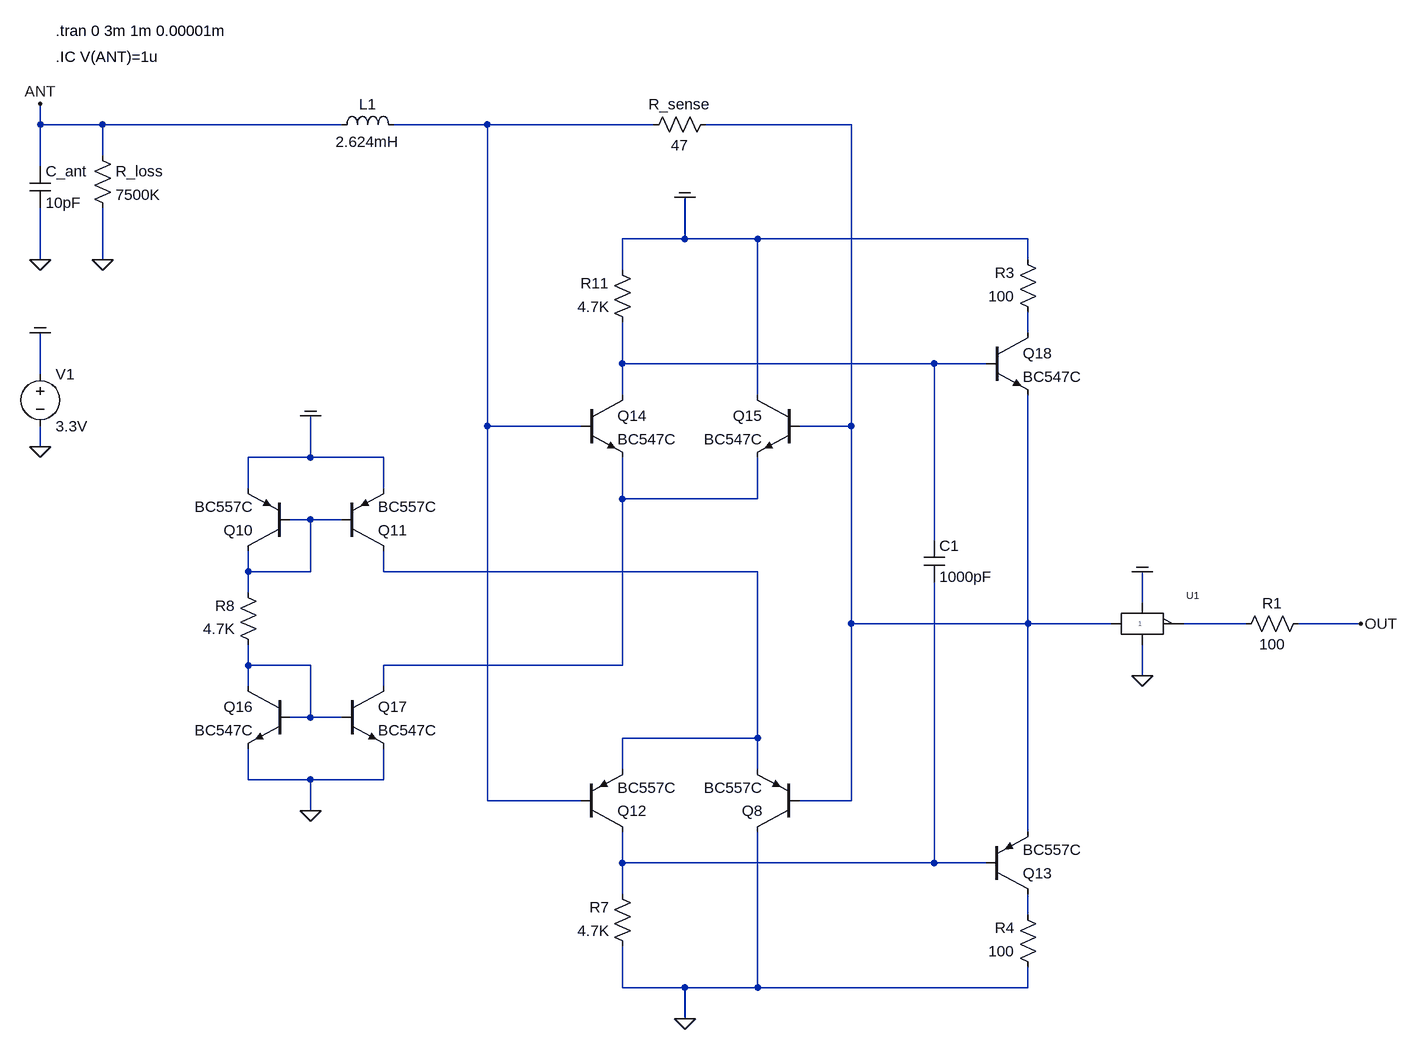
[diagram p0: schematic 2020_current_sense_npn_pnp_v02.asc]
2020_current_sense_npn_pnp_v02.asc, the LTspice schematic file:
Version 4
SHEET 1 3920 3748
WIRE -832 480 -832 448
WIRE -736 480 -832 480
WIRE -368 480 -736 480
WIRE -144 480 -288 480
WIRE 112 480 -144 480
WIRE 416 480 192 480
WIRE -736 528 -736 480
WIRE -832 544 -832 480
WIRE 160 656 160 592
WIRE 160 656 64 656
WIRE 272 656 160 656
WIRE 688 656 272 656
WIRE -832 688 -832 608
WIRE -736 688 -736 608
WIRE 688 688 688 656
WIRE 64 704 64 656
WIRE 688 800 688 768
WIRE 64 848 64 784
WIRE 544 848 64 848
WIRE 624 848 544 848
WIRE -832 864 -832 800
WIRE 64 896 64 848
WIRE 272 896 272 656
WIRE -144 944 -144 480
WIRE 0 944 -144 944
WIRE 416 944 416 480
WIRE 416 944 336 944
WIRE -832 976 -832 944
WIRE -416 992 -416 928
WIRE -416 992 -512 992
WIRE -304 992 -416 992
WIRE -512 1040 -512 992
WIRE -304 1040 -304 992
WIRE 64 1056 64 992
WIRE 272 1056 272 992
WIRE 272 1056 64 1056
WIRE -416 1088 -448 1088
WIRE -368 1088 -416 1088
WIRE 544 1120 544 848
WIRE -512 1168 -512 1136
WIRE -416 1168 -416 1088
WIRE -416 1168 -512 1168
WIRE -304 1168 -304 1136
WIRE 272 1168 -304 1168
WIRE -512 1200 -512 1168
WIRE 864 1216 864 1168
WIRE 416 1248 416 944
WIRE 688 1248 688 896
WIRE 688 1248 416 1248
WIRE 816 1248 688 1248
WIRE 1024 1248 928 1248
WIRE 1200 1248 1104 1248
WIRE -512 1312 -512 1280
WIRE -416 1312 -512 1312
WIRE 64 1312 64 1056
WIRE 64 1312 -304 1312
WIRE 864 1328 864 1280
WIRE -512 1344 -512 1312
WIRE -304 1344 -304 1312
WIRE -416 1392 -416 1312
WIRE -416 1392 -448 1392
WIRE -368 1392 -416 1392
WIRE 272 1424 272 1168
WIRE 272 1424 64 1424
WIRE 64 1472 64 1424
WIRE 272 1472 272 1424
WIRE -512 1488 -512 1440
WIRE -416 1488 -512 1488
WIRE -304 1488 -304 1440
WIRE -304 1488 -416 1488
WIRE -144 1520 -144 944
WIRE 0 1520 -144 1520
WIRE 416 1520 416 1248
WIRE 416 1520 336 1520
WIRE -416 1536 -416 1488
WIRE 688 1568 688 1248
WIRE 64 1616 64 1568
WIRE 544 1616 544 1184
WIRE 544 1616 64 1616
WIRE 624 1616 544 1616
WIRE 64 1664 64 1616
WIRE 688 1696 688 1664
WIRE 64 1808 64 1744
WIRE 160 1808 64 1808
WIRE 272 1808 272 1568
WIRE 272 1808 160 1808
WIRE 688 1808 688 1776
WIRE 688 1808 272 1808
WIRE 160 1856 160 1808
FLAG -832 976 0
FLAG -832 800 COM
FLAG -832 688 0
FLAG -832 448 ANT
FLAG -736 688 0
FLAG 160 1856 0
FLAG -416 928 COM
FLAG -416 1536 0
FLAG 160 592 COM
FLAG 1200 1248 OUT
FLAG 864 1168 COM
FLAG 864 1328 0
SYMBOL voltage -832 848 R0
WINDOW 123 0 0 Left 0
WINDOW 39 0 0 Left 0
SYMATTR InstName V1
SYMATTR Value 3.3V
SYMBOL ind -384 496 R270
WINDOW 0 32 56 VTop 2
WINDOW 3 5 56 VBottom 2
SYMATTR InstName L1
SYMATTR Value 2.624mH
SYMATTR SpiceLine Rser=80 Rpar=100Meg Cpar=1.216pF
SYMBOL cap -848 544 R0
SYMATTR InstName C_ant
SYMATTR Value 10pF
SYMBOL res -752 512 R0
SYMATTR InstName R_loss
SYMATTR Value 7500K
SYMBOL res 208 464 R90
WINDOW 0 0 56 VBottom 2
WINDOW 3 32 56 VTop 2
SYMATTR InstName R_sense
SYMATTR Value 47
SYMBOL pnp 336 1568 R180
SYMATTR InstName Q8
SYMATTR Value BC557C
SYMBOL pnp -448 1136 R180
SYMATTR InstName Q10
SYMATTR Value BC557C
SYMBOL pnp -368 1136 M180
SYMATTR InstName Q11
SYMATTR Value BC557C
SYMBOL pnp 0 1568 M180
SYMATTR InstName Q12
SYMATTR Value BC557C
SYMBOL res 80 1760 R180
WINDOW 0 36 76 Left 2
WINDOW 3 36 40 Left 2
SYMATTR InstName R7
SYMATTR Value 4.7K
SYMBOL res -496 1296 R180
WINDOW 0 36 76 Left 2
WINDOW 3 36 40 Left 2
SYMATTR InstName R8
SYMATTR Value 4.7K
SYMBOL pnp 624 1664 M180
SYMATTR InstName Q13
SYMATTR Value BC557C
SYMBOL npn 0 896 R0
SYMATTR InstName Q14
SYMATTR Value BC547C
SYMBOL npn 336 896 M0
SYMATTR InstName Q15
SYMATTR Value BC547C
SYMBOL npn -448 1344 M0
SYMATTR InstName Q16
SYMATTR Value BC547C
SYMBOL npn -368 1344 R0
SYMATTR InstName Q17
SYMATTR Value BC547C
SYMBOL res 80 800 R180
WINDOW 0 36 76 Left 2
WINDOW 3 36 40 Left 2
SYMATTR InstName R11
SYMATTR Value 4.7K
SYMBOL npn 624 800 R0
SYMATTR InstName Q18
SYMATTR Value BC547C
SYMBOL res 704 784 R180
WINDOW 0 36 76 Left 2
WINDOW 3 36 40 Left 2
SYMATTR InstName R3
SYMATTR Value 100
SYMBOL res 704 1792 R180
WINDOW 0 36 76 Left 2
WINDOW 3 36 40 Left 2
SYMATTR InstName R4
SYMATTR Value 100
SYMBOL 74AHC1G04 864 1200 R0
SYMATTR InstName U1
SYMBOL res 1008 1264 R270
WINDOW 0 32 56 VTop 2
WINDOW 3 0 56 VBottom 2
SYMATTR InstName R1
SYMATTR Value 100
SYMBOL cap 528 1120 R0
SYMATTR InstName C1
SYMATTR Value 1000pF
TEXT -808 336 Left 2 !.tran 0 3m 1m 0.00001m
TEXT -808 376 Left 2 !.IC V(ANT)=1u

The netlist it stands for:
* 2020_current_sense_npn_pnp_v02.asc
V1 COM 0 3.3V
L1 ANT N001 2.624mH Rser=80 Rpar=100Meg Cpar=1.216pF
C_ant ANT 0 10pF
R_loss ANT 0 7500K
R_sense N002 N001 47
Q8 0 N002 N007 0 BC557C
Q10 N006 N006 COM 0 BC557C
Q11 N007 N006 COM 0 BC557C
Q12 N010 N001 N007 0 BC557C
R7 0 N010 4.7K
R8 N009 N006 4.7K
Q13 N011 N010 N002 0 BC557C
Q14 N004 N001 N005 0 BC547C
Q15 COM N002 N005 0 BC547C
Q16 N009 N009 0 0 BC547C
Q17 N005 N009 0 0 BC547C
R11 N004 COM 4.7K
Q18 N003 N004 N002 0 BC547C
R3 N003 COM 100
R4 0 N011 100
XU1 N002 N008 COM 0 74AHC1G04  ; pins in out vcc gnd
R1 N008 OUT 100
C1 N004 N010 1000pF
.model NPN NPN
.model PNP PNP
.lib standard.bjt
.tran 0 3m 1m 0.00001m
.IC V(ANT)=1u
.lib 74AHC1G04.cir
.backanno
.end